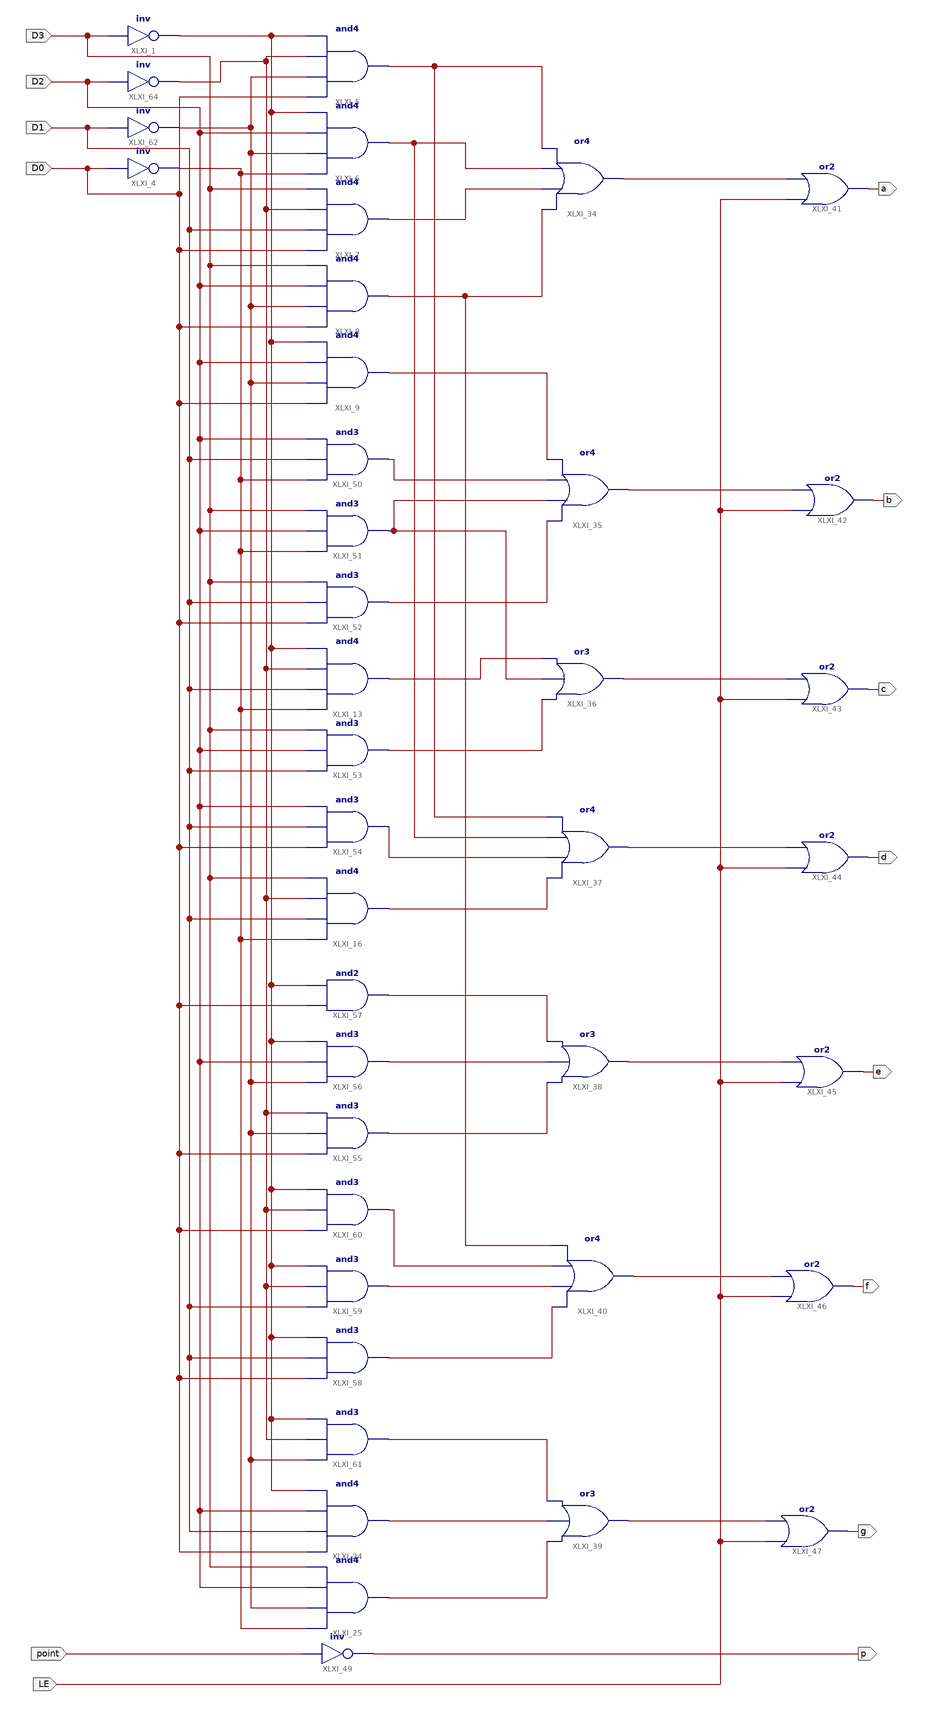
[diagram p0: schematic sheet 1]
// Xilinx ISE schematic MC14495_ZJU_sch.sch (spartan3) as structural Verilog: 40 symbols, 14 ports
module MC14495_ZJU_sch (
  input  D3,
  input  D2,
  input  D1,
  input  D0,
  input  point,
  input  LE,
  output a,
  output b,
  output c,
  output d,
  output e,
  output f,
  output g,
  output p
);

  wire D3_, XLXN_17, XLXN_21, XLXN_29, XLXN_30, XLXN_31, XLXN_32, XLXN_37, XLXN_38, XLXN_39, XLXN_40,
       XLXN_41, XLXN_42, XLXN_43, XLXN_44, XLXN_45, XLXN_46, XLXN_48, XLXN_49, XLXN_52, XLXN_53, XLXN_54,
       XLXN_57, XLXN_58, XLXN_59, XLXN_60, XLXN_61, XLXN_62, XLXN_63, XLXN_64, XLXN_67, XLXN_78;

  and XLXI_5 (XLXN_41, D0, XLXN_21, XLXN_78, D3_);
  and XLXI_6 (XLXN_42, XLXN_17, XLXN_21, D2, D3_);
  and XLXI_7 (XLXN_64, D0, D1, XLXN_78, D3);
  and XLXI_8 (XLXN_67, D0, XLXN_21, D2, D3);
  and XLXI_9 (XLXN_29, D0, XLXN_21, D2, D3_);
  and XLXI_13 (XLXN_37, XLXN_17, D1, XLXN_78, D3_);
  and XLXI_16 (XLXN_40, XLXN_17, D1, XLXN_78, D3);
  and XLXI_24 (XLXN_53, D0, D1, D2, D3_);
  and XLXI_25 (XLXN_54, XLXN_17, XLXN_21, D2, D3);
  not XLXI_1 (D3_, D3);
  not XLXI_4 (XLXN_17, D0);
  or XLXI_34 (XLXN_57, XLXN_67, XLXN_64, XLXN_42, XLXN_41);
  or XLXI_35 (XLXN_58, XLXN_32, XLXN_31, XLXN_30, XLXN_29);
  or XLXI_36 (XLXN_59, XLXN_38, XLXN_31, XLXN_37);
  or XLXI_37 (XLXN_60, XLXN_40, XLXN_39, XLXN_42, XLXN_41);
  or XLXI_38 (XLXN_61, XLXN_45, XLXN_44, XLXN_43);
  or XLXI_39 (XLXN_63, XLXN_54, XLXN_53, XLXN_52);
  or XLXI_40 (XLXN_62, XLXN_49, XLXN_48, XLXN_46, XLXN_67);
  or XLXI_41 (a, LE, XLXN_57);
  or XLXI_42 (b, LE, XLXN_58);
  or XLXI_43 (c, LE, XLXN_59);
  or XLXI_44 (d, LE, XLXN_60);
  or XLXI_45 (e, LE, XLXN_61);
  or XLXI_46 (f, LE, XLXN_62);
  or XLXI_47 (g, LE, XLXN_63);
  not XLXI_49 (p, point);
  and XLXI_50 (XLXN_30, XLXN_17, D1, D2);
  and XLXI_51 (XLXN_31, XLXN_17, D2, D3);
  and XLXI_52 (XLXN_32, D0, D1, D3);
  and XLXI_53 (XLXN_38, D1, D2, D3);
  and XLXI_54 (XLXN_39, D0, D1, D2);
  and XLXI_55 (XLXN_45, D0, XLXN_21, XLXN_78);
  and XLXI_56 (XLXN_44, XLXN_21, D2, D3_);
  and XLXI_57 (XLXN_43, D0, D3_);
  and XLXI_58 (XLXN_49, D0, D1, D3_);
  and XLXI_59 (XLXN_48, D1, XLXN_78, D3_);
  and XLXI_60 (XLXN_46, D0, XLXN_78, D3_);
  and XLXI_61 (XLXN_52, XLXN_21, XLXN_78, D3_);
  not XLXI_62 (XLXN_21, D1);
  not XLXI_64 (XLXN_78, D2);
endmodule
